# Altium schematic sheet Sheet 2 - Moteurs.SchDoc
size A4
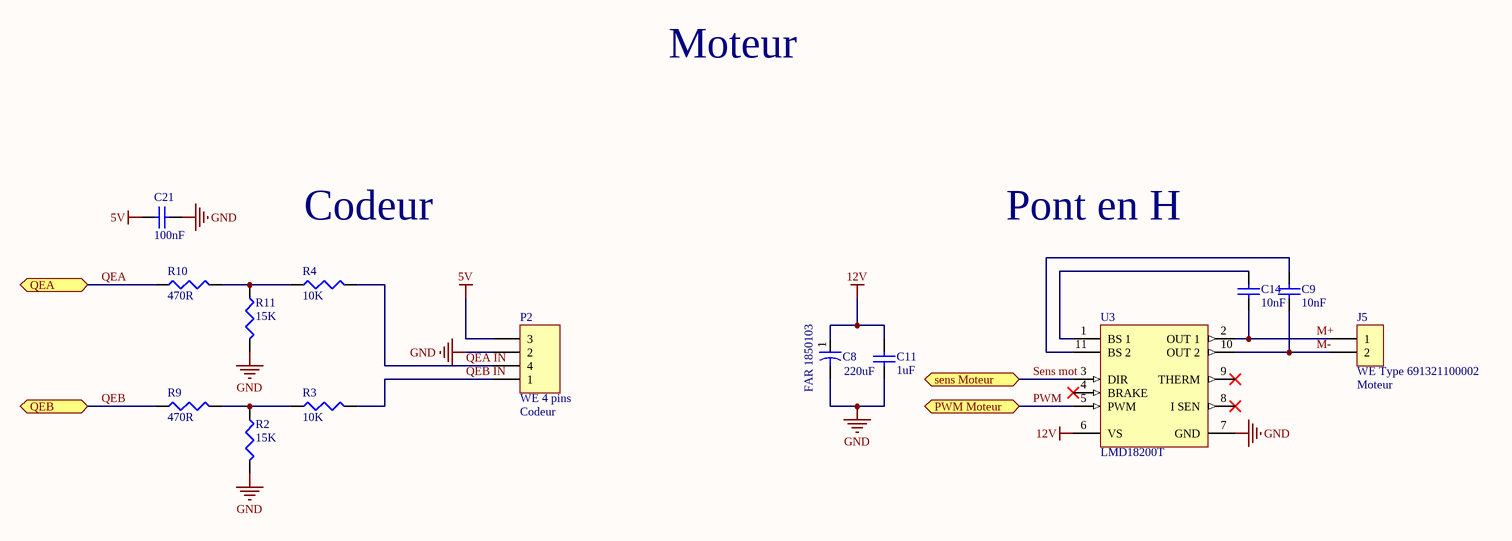
[diagram p0: Sheet 2 - Moteurs.SchDoc]

## Parts
C8  réference commande: FAR 1850103  [Capa CMS D6.3_E1.8]  (hidden comment: 220uF)
C9  10nF  [C0805]
C11  1uF  [C0805]
C14  10nF  [C0805]
C21  100nF  [C0805]
J5  WE Type 691321100002  value1: Moteur  [691321100002]
P2  WE 4 pins  value1: Codeur  [690367280476]
R2  15K  [0805]
R3  10K  [0805]
R4  10K  [0805]
R9  470R  [0805]
R10  470R  [0805]
R11  15K  [0805]
U3  LMD18200T  [TA11B]

## Ports
PWM Moteur (bidir), QEA (bidir), QEB (bidir), sens Moteur (bidir)

## Nets
5V: C21.2 P2.3
12V: C8.1 C11.2 U3.6(VS)
GND: C8.2 C11.1 C21.1 P2.2 R2.2 R11.2 U3.7(GND)
M+: C14.2 J5.1 U3.2(OUT_1)
M-: C9.2 J5.2 U3.10(OUT_2)
PWM: U3.5(PWM) ; port PWM Moteur
QEA: R10.1 ; port QEA
QEA IN: P2.4 R4.2
QEB: R9.1 ; port QEB
QEB IN: P2.1 R3.2
Sens mot: U3.3(DIR) ; port sens Moteur
NetC9_1: C9.1 U3.11(BS_2)
NetC14_1: C14.1 U3.1(BS_1)
NetR2_1: R2.1 R3.1 R9.2
NetR4_1: R4.1 R10.2 R11.1

Not connected (* = marked no-connect by the designer): U3 4(BRAKE)* 8(I_SEN)* 9(THERM)*

## Notes on the sheet
- Moteur
- Codeur
- Pont en H

## Library data of the parts
C8 = Cap2: EEEFK1C221XP; Published: 23-Sep-2002; PackageReference: CAPR5-4X5; Publisher: Altium Limited; Value: 220uF; Supplier 1: Farnell; Supplier Part Number 1: 185-0103
C9 C11 C14 C21 = Cap: Capacitor 0805; Published: 8-Jun-2000; LatestRevisionDate: 17-Jul-2002; LatestRevisionNote: Re-released for DXP Platform.; PackageReference: RAD-0.3; Publisher: Altium Limited
  C9 C14: Value: 10nF
  C11: Value: 1uF
  C21: value: 100nF
J5 = WE-Terminal Blocks Plugable Type 691321100002: WR-TBL Terminal block - serie 3211 - 3.50 mm; Manufacturer: W¨¹rth Elektronik eiSos GmbH; ComponentLink1 Description: Manufacturer; ComponentLink2 Description: Datasheet; NoPins: 2; Created Date: 9 December 2013; value: 691321100002; ComponentLink1URL: http://www.we-online.com; ComponentLink2URL: http://katalog.we-online.de/em/datasheet/6913211000xx.pdf; Created by: Karrer Zheng; Supplier Part Number 1: 3704816; Supplier 1: Farnell
P2 = MHDR1X4: Header, 4-Pin; value: 690367280476; LatestRevisionDate: 17-Jul-2002; LatestRevisionNote: Re-released for DXP Platform.; Publisher: Altium Limited; Supplier Part Number 1: 378-4710; Supplier 1: Farnell
R2 R3 R9 = Res3: Resistor 0805; Value: 1K; Published: 8-Jun-2000; LatestRevisionDate: 29-May-2009; LatestRevisionNote: IPC-7351 Footprint Added.; PackageReference: J1-0603; Publisher: Altium Limited; PackageDescription: Chip Resistor
R4 R10 R11 = Res3: Resistor 0805; Published: 8-Jun-2000; LatestRevisionDate: 29-May-2009; LatestRevisionNote: IPC-7351 Footprint Added.; PackageReference: J1-0603; Publisher: Altium Limited; PackageDescription: Chip Resistor
  R4: Value: 10K
  R10: Value: 470R
  R11: Value: 15k
U3 = LMD18200T: 3A, 55V H-Bridge; Manufacturer: National Semiconductor; CompType: MiscPower; PackageTopMarking: NSUZXYTTE#*LMD18200T*P+; PowerWise: N; FirstPublished: 4-Dec-2008; DatasheetVersion: Apr-2005; PackageVersion: revA, Mar-1987; PackageReference: TA11B; Publisher: Altium Limited; PackageDescription: TO-220, Molded, .788 x .421in Body, 11 Lead, .067in Pitch; Value: LMD18200T; RoHS: O; PinCount: 11; DigiKeyPartNumber: LMD18200T-ND; ComponentLink1Description: LMD18200 Datasheet; ComponentLink1URL: http://www.national.com/ds/LM/LMD18200.pdf; ComponentLink2Description: LMD18200 Web Page; ComponentLink2URL: http://www.national.com/pf/LM/LMD18200.html; ComponentLink3Description: TA11B Package Page; ComponentLink3URL: http://www.national.com/packaging/folders/ta11b.html; Supplier 1: Farnell; Supplier Part Number 1: 948-8030